# Altium schematic sheet LM3150_BuckConverter.SchDoc
size A; SheetNumber: 1; SheetTotal: 1
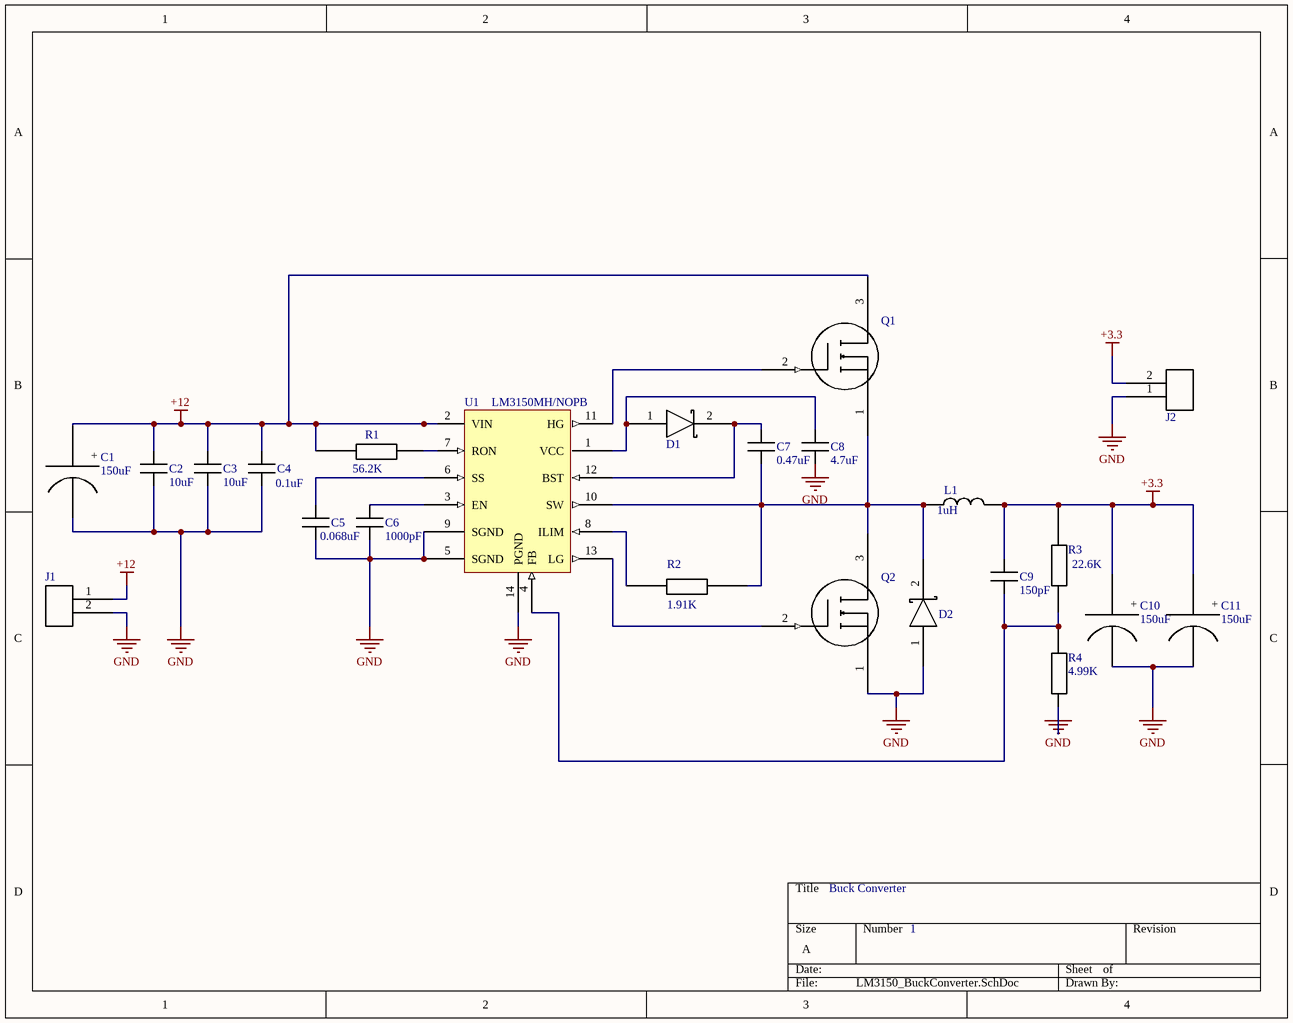
[diagram p0: LM3150_BuckConverter.SchDoc]

## Parts
C1  value 150uF  [Cap860010675016]  (hidden comment: Cin1)
C2  value 10uF  [C1206]
C3  value 10uF  [C1206]  (hidden comment: Cin3)
C4  value 0.1uF  [C0805]  (hidden comment: Cbyp)
C5  value 0.068uF  [C0805]  (hidden comment: Css)
C6  value 1000pF  [C0805]  (hidden comment: Cen)
C7  value 0.47uF  [C0805]  (hidden comment: Cbst)
C8  value 4.7uF  [C0805]  (hidden comment: Cvcc)
C9  value 150pF  [C0805]  (hidden comment: Cff)
C10  value 150uF  [A765EB157M0JLAE020]  (hidden comment: Co1)
C11  value 150uF  [A765EB157M0JLAE020]  (hidden comment: Co2)
D1  Dbst  [CUS08F30]  (value not drawn)
D2  Schottky  [CUS08F30]  (value not drawn)
J1  Input  [TB006-508-02BE]  (value not drawn)
J2  Output  [TB006-508-02BE]  (value not drawn)
L1  value 1uH  [MPCV1060L1R0]  (hidden comment: Coil)
Q1  Mosfet  [CSD18540Q5B]  (value not drawn)
Q2  Mosfet  [CSD18540Q5B]  (value not drawn)
R1  value 56.2K  [R0805]  (hidden comment: Ron)
R2  value 1.91K  [R0805]  (hidden comment: Rlim)
R3  value 22.6K  [R0805]  (hidden comment: Rfb2)
R4  value 4.99K  [R0805]  (hidden comment: Rfb1)
U1  LM3150MH/NOPB  [LM3150MH/NOPB]

## Nets
+3.3: C9.2 C10.1(+) C11.1(+) J2.2 L1.2 R3.1
+12: C1.1(+) C2.2 C3.2 C4.2 J1.1 Q1.3(D) R1.2 U1.2(VIN)
GND: C1.2(-) C2.1 C3.1 C4.1 C5.1 C6.1 C8.2 C10.2(-) C11.2(-) D2.1(-) J1.2 J2.1 Q2.1(S) R4.2 U1.5(SGND) U1.9(SGND) U1.14(PGND)
NetC5_2: C5.2 U1.6(SS)
NetC6_2: C6.2 U1.3(EN)
NetC7_1: C7.1 D1.2(+) U1.12(BST)
NetC7_2: C7.2 D2.2(+) L1.1 Q1.1(S) Q2.3(D) R2.1 U1.10(SW)
NetC8_1: C8.1 D1.1(-) U1.1(VCC)
NetC9_1: C9.1 R3.2 R4.1 U1.4(FB)
NetQ1_2: Q1.2(G) U1.11(HG)
NetQ2_2: Q2.2(G) U1.13(LG)
NetR1_1: R1.1 U1.7(RON)
NetR2_2: R2.2 U1.8(ILIM)

## Notes on the sheet
- Buck Converter
- 1

## Library data of the parts
C1 = Polarized_Cap: CAP ALUM 150UF 20% 63V RADIAL; Manufacturer: Würth Elektronik; Manufacturer part number: 860010675016
C2 C3 = Capacitor: CAP CER 10UF 25V X7R 1206; Manufacturer: Samsung Electro-Mechanics; Manufacturer part number: CL31B106KAHVPNE
C4 = Capacitor: CAP CER 0.1UF 50V X7R 0805; Manufacturer: AVX Corporation; Manufacturer part number: 08055C104KAT2A
C5 = Capacitor: CAP CER 0.068UF 25V X7R 0805; Manufacturer: YAGEO; Manufacturer part number: CC0805KRX7R8BB683
C6 = Capacitor: CAP CER 1000PF 50V X7R 0805; Manufacturer: Samsung Electro-Mechanics; Manufacturer part number: CL21B102KBCNNNC
C7 = Capacitor: CAP CER 0.47UF 16V X7R 0805; Manufacturer: Samsung Electro-Mechanics; Manufacturer part number: CL21B474KOFNNNE
C8 = Capacitor: CAP CER 4.7UF 16V X7R 0805; Manufacturer: Taiyo Yuden; Manufacturer part number: EMK212B7475KG-T
C9 = Capacitor: CAP CER 150PF 50V C0G/NPO 0805; Manufacturer: YAGEO; Manufacturer part number: CC0805JRNPO9BN151
C10 C11 = Polarized_Cap: CAP ALUM POLY 150UF 20% 6.3V SMD; Manufacturer: KEMET; Manufacturer part number: A765EB157M0JLAE020
D1 D2 = Schottky: DIODE SCHOTTKY 30V 800MA USC; Manufacturer part number: CUS08F30,H3F; Manufacturer: Toshiba Semiconductor and Storage
J1 J2 = Terminal_Block: TERMINAL BLOCK, SCREW TYPE, 5.08; Manufacturer: CUI Devices; Manufacturer part number: TB006-508-02BE
L1 = Coil: FIXED IND 1UH 26A 1.87 MOHM SMD; Manufacturer: KEMET; Manufacturer part number: MPCV1060L1R0
Q1 Q2 = Mosfet: MOSFET N-CH 60V 100A 8VSON; Manufacturer: Texas Instruments; Manufacturer part number: CSD18540Q5B
R1 = Resistor: RES 56.2K OHM 1% 1/8W 0805; Manufacturer: Stackpole Electronics Inc; Manufacturer part number: RMCF0805FT56K2
R2 = Resistor: RES SMD 1.91K OHM 1% 1/8W 0805; Manufacturer: YAGEO; Manufacturer part number: RC0805FR-071K91L
R3 = Resistor: RES SMD 22.6K OHM 1% 1/8W 0805; Manufacturer: Vishay Dale; Manufacturer part number: CRCW080522K6FKEA
R4 = Resistor: RES 4.99K OHM 1% 1/8W 0805; Manufacturer: Stackpole Electronics Inc; Manufacturer part number: RMCF0805FT4K99
U1 = LM3150MH/NOPB: IC REG CTRLR BUCK 14TSSOP; Manufacturer: Texas Instruments; Manufacturer part number: LM3150MHNOPB